# Altium schematic sheet MCU.SchDoc: Motor Controller Board
size A4; DrawnBy: Hüseyin Yanar; DocumentNumber: 2; Revision: VER 1.0; SheetNumber: 2; SheetTotal: 4
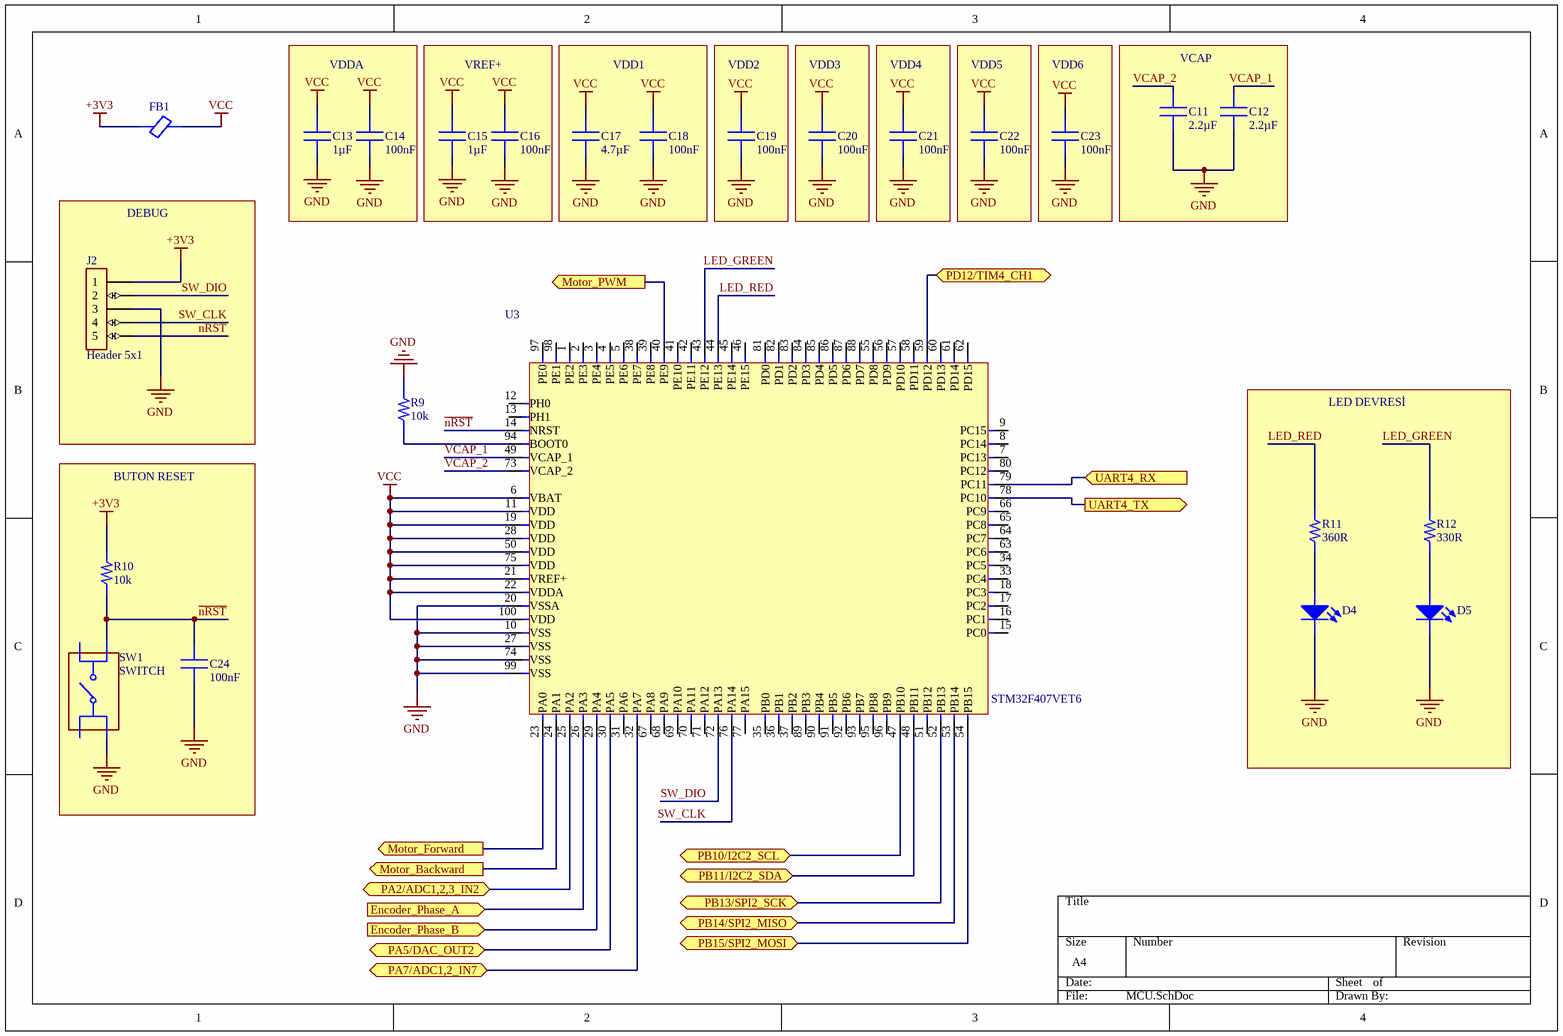
[diagram p0: MCU.SchDoc]

## Parts
C11  2.2µF  [CAP 0402 2.2UF]
C12  2.2µF  [CAP 0402 2.2UF]
C13  1µF  [CAP 1uF 0402]
C14  100nF  [CAP 100nF 0402]
C15  1µF  [CAP 1uF 0402]
C16  100nF  [CAP 100nF 0402]
C17  4.7µF  [CAP 0402 4.7uF]
C18  100nF  [CAP 100nF 0402]
C19  100nF  [CAP 100nF 0402]
C20  100nF  [CAP 100nF 0402]
C21  100nF  [CAP 100nF 0402]
C22  100nF  [CAP 100nF 0402]
C23  100nF  [CAP 100nF 0402]
C24  100nF  [CAP 100nF 0402]
D4  LED RED  [LED RED 0603 APT1608EC]  (value not drawn)
D5  LED GREEN  [LED GREEN 0603 APT1608CGCK]  (value not drawn)
FB1  BLM18PG221SN1D  [FB 0603 BLM18PG221SN1D]  (value not drawn)
J2  Header 5x1  [5x1 Header]
R9  10k  [RES 0402 ROYALOHM GENERAL]
R10  10k  [RES 0402 ROYALOHM GENERAL]
R11  360R  [ROYALOHM 0603 RES]
R12  330R  [ROYALOHM 0603 RES]
SW1  SWITCH  [PTS647SM50SMTR2 SMD BUTTON]
U3  STM32F407VET6  [LQFP100-0.5-13.8X13.8MM]

## Blocks framed on the sheet
VDDA: C13 C14
VREF+: C15 C16
VDD1: C17 C18
VDD2: C19
VDD3: C20
VDD4: C21
VDD5: C22
VDD6: C23
VCAP: C11 C12
DEBUG: J2
LED DEVRESİ: D4 D5 R11 R12
BUTON RESET: C24 R10 SW1

## Ports
Encoder_Phase_A (in, see Sensors_and_External_Interfaces[1A]), Encoder_Phase_B (in, see Sensors_and_External_Interfaces[1B]), Motor_Backward (out, see Motor_Controller[1A]), Motor_Forward (out, see Motor_Controller[1A]), Motor_PWM (out, see Motor_Controller[3C]), PA2/ADC1,2,3_IN2 (bidir, see Sensors_and_External_Interfaces[3B]), PA5/DAC_OUT2 (bidir, see Sensors_and_External_Interfaces[3B]), PA7/ADC1,2_IN7 (bidir, see Sensors_and_External_Interfaces[3B]), PB10/I2C2_SCL (bidir, see Sensors_and_External_Interfaces[3A]), PB11/I2C2_SDA (bidir, see Sensors_and_External_Interfaces[3A]), PB13/SPI2_SCK (bidir, see Sensors_and_External_Interfaces[3A]), PB14/SPI2_MISO (bidir, see Sensors_and_External_Interfaces[3A]), PB15/SPI2_MOSI (bidir, see Sensors_and_External_Interfaces[3A]), PD12/TIM4_CH1 (bidir, see Sensors_and_External_Interfaces[3A]), UART4_RX (in, see Sensors_and_External_Interfaces[3A]), UART4_TX (out, see Sensors_and_External_Interfaces[3B])

## Nets
+3V3: FB1.1 J2.1 R10.2
GND: C11.1 C12.1 C13.1 C14.1 C15.1 C16.1 C17.1 C18.1 C19.1 C20.1 C21.1 C22.1 C23.1 C24.1 D4.C(Cathode) D5.C(Cathode) J2.3 R9.2 SW1.2(A2) U3.10(VSS) U3.20(VSSA) U3.27(VSS) U3.74(VSS) U3.99(VSS)
VCC: C13.2 C14.2 C15.2 C16.2 C17.2 C18.2 C19.2 C20.2 C21.2 C22.2 C23.2 FB1.2 U3.6(VBAT) U3.11(VDD) U3.19(VDD) U3.21(VREF+) U3.22(VDDA) U3.28(VDD) U3.50(VDD) U3.75(VDD) U3.100(VDD)
~{nRST}: C24.2 J2.5 R10.1 SW1.4(B2) U3.14(NRST)
Encoder_Phase_A: U3.26(PA3) ; port Encoder_Phase_A
Encoder_Phase_B: U3.29(PA4) ; port Encoder_Phase_B
LED_GREEN: R12.2 U3.43(PE12)
LED_RED: R11.2 U3.44(PE13)
Motor_Backward: U3.24(PA1) ; port Motor_Backward
Motor_Forward: U3.23(PA0) ; port Motor_Forward
Motor_PWM: U3.40(PE9) ; port Motor_PWM
PA2/ADC1,2,3_IN2: U3.25(PA2) ; port PA2/ADC1,2,3_IN2
PA5/DAC_OUT2: U3.30(PA5) ; port PA5/DAC_OUT2
PA7/ADC1,2_IN7: U3.32(PA7) ; port PA7/ADC1,2_IN7
PB10/I2C2_SCL: U3.47(PB10) ; port PB10/I2C2_SCL
PB11/I2C2_SDA: U3.48(PB11) ; port PB11/I2C2_SDA
PB13/SPI2_SCK: U3.52(PB13) ; port PB13/SPI2_SCK
PB14/SPI2_MISO: U3.53(PB14) ; port PB14/SPI2_MISO
PB15/SPI2_MOSI: U3.54(PB15) ; port PB15/SPI2_MOSI
PD12/TIM4_CH1: U3.59(PD12) ; port PD12/TIM4_CH1
SW_CLK: J2.4 U3.76(PA14)
SW_DIO: J2.2 U3.72(PA13)
UART4_RX: U3.79(PC11) ; port UART4_RX
UART4_TX: U3.78(PC10) ; port UART4_TX
VCAP_1: C12.2 U3.49(VCAP_1)
VCAP_2: C11.2 U3.73(VCAP_2)
NetD4_A: D4.A(Anode) R11.1
NetD5_A: D5.A(Anode) R12.1
NetR9_1: R9.1 U3.94(BOOT0)

Not connected (* = marked no-connect by the designer): SW1 1(A1) 3(B1); U3 1(PE2) 2(PE3) 3(PE4) 4(PE5) 5(PE6) 7(PC13) 8(PC14) 9(PC15) 12(PH0) 13(PH1) 15(PC0) 16(PC1) 17(PC2) 18(PC3) 31(PA6) 33(PC4) 34(PC5) 35(PB0) 36(PB1) 37(PB2) 38(PE7) 39(PE8) 41(PE10) 42(PE11) 45(PE14) 46(PE15) 51(PB12) 55(PD8) 56(PD9) 57(PD10) 58(PD11) 60(PD13) 61(PD14) 62(PD15) 63(PC6) 64(PC7) 65(PC8) 66(PC9) 67(PA8) 68(PA9) 69(PA10) 70(PA11) 71(PA12) 77(PA15) 80(PC12) 81(PD0) 82(PD1) 83(PD2) 84(PD3) 85(PD4) 86(PD5) 87(PD6) 88(PD7) 89(PB3) 90(PB4) 91(PB5) 92(PB6) 93(PB7) 95(PB8) 96(PB9) 97(PE0) 98(PE1)

## Notes on the sheet
- VDDA 100nF ve 1µF VDDA/VSSA pinlerine en yakın olacak
  GND dönüşleri kısa olacak ve mümkünse analog GND bölgesine temiz inecek
  VDD 100nF’ler de her VDD pin grubuna yakın olacak.

## Library data of the parts
C11 C12 = CAP 0402 2.2uF CL05A225KO5NQNC: MLCC (1005) 0402 2.2uF 16VDC ±10% X5R CL05A225KO5NQNC; Manufacturer: SAMSUNG; Operation Temperature: -55 °C ~ +85 °C; Manufacturer Code: CL05A225KO5NQNC; Manufacturer Site: https://www.ozdisan.com/en/p/smt-smd-and-mlcc-capacitors-184/samsung-cl05a225ko5nqnc-521869; Package / Case: 0402 (1005 Metric); Capacitance: 2.2µF; Voltage Rating: 16 VDC; Tolerance: ±10 %; Dielectric Material: X5R
C13 C15 = CAP 0402 1µF CL05A105KO5NNNC: MLCC (1005) 0402 1uF 16VDC ±10% X5R CL05A105KO5NNNC; Manufacturer: SAMSUNG; Operation Temperature: -55 °C ~ +85 °C; Manufacturer Code: CL05A105KO5NNNC; Manufacturer Site: https://www.ozdisan.com/en/p/smt-smd-and-mlcc-capacitors-184/samsung-cl05a105ko5nnnc-402953; Package / Case: 0402 (1005 Metric); Capacitance: 1µF; Voltage Rating: 16 VDC; Tolerance: ±10 %; Dielectric Material: X5R; Mounting Type: SMT
C14 C16 C18-C23 = CAP 0402 100nF: MLCC (1005) 0402 100nF 16VDC ±10% X7R; Manufacturer Code: CL05B104KO5NNNC; Manufacturer: SAMSUNG; Operation Temperature: -55 °C ~ +125 °C; Dielectric Material: X7R; Tolerance: ±10 %; Voltage Rating: 16 VDC; Package / Case: 0402 (1005 Metric); Mounting Type: SMT; Manufacturer Site: https://www.ozdisan.com/en/p/smt-smd-and-mlcc-capacitors-184/samsung-cl05b104ko5nnnc-336698; Capacitance: 100 nF
C17 = CAP 0402 4.7uF CL05A475MO5LUNC: MLCC (1005) 0402 4.7uF 16VDC ±20% X5R CL05A475MO5LUNC; Manufacturer: SAMSUNG; Operation Temperature: -55 °C ~ +85 °C; Manufacturer Code: CL05A475MO5LUNC; Manufacturer Site: https://www.ozdisan.com/en/p/smt-smd-and-mlcc-capacitors-184/samsung-cl05a475mo5lunc-1212612; Package / Case: 0402 (1005 Metric); Capacitance: 4.7µF; Voltage Rating: 16 VDC; Tolerance: ±20 %; Dielectric Material: X5R; Mounting Type: SMT
C24 = CAP 0402 100nF CL05B104KO5NNNC: MLCC (1005) 0402 100nF 16VDC ±10% X7R CL05B104KO5NNNC; Manufacturer: SAMSUNG; Operation Temperature: -55 °C ~ +125 °C; Dielectric Material: X7R; Tolerance: ±10 %; Voltage Rating: 16 VDC; Package / Case: 0402 (1005 Metric); Mounting Type: SMT; Manufacturer Site: https://www.ozdisan.com/en/p/smt-smd-and-mlcc-capacitors-184/samsung-cl05b104ko5nnnc-336698; Manufacturer Code: CL05B104KO5NNNC; Capacitance: 100 nF
D4 = SMD LED RED APT1608EC: LED SMD 0603 RED 617nm CLEAR CHIP SMD; Manufacturer: KINGBRIGHT; Max Power: 75 mW; Transmission Voltage: 2.1V - 2.5V; Transmission Current: 30 mA; Manufacturer Site: https://www.ozdisan.com/p/sinyal-ledler-tek-renkli-361/kingbright-apt1608ec-1046629; Operating Temp.: -40 °C ~ +85 °C; Manufacturer Code: APT1608EC
D5 = SMD LED GREEN APT1608CGCK: LED GREEN CLEAR CHIP SMD; Manufacturer: KINGBRIGHT; Max Power: 75 mW; Light Intensity: 18 - 35 cmd; Transmission Voltage: 2.1 - 2.5V; Transmission Current: 30 mA; Manufacturer Site: https://www.ozdisan.com/p/sinyal-ledler-tek-renkli-361/kingbright-apt1608cgck-1050108; Color: Green; Package Size: 0603; Operating Temp.: -30 °C ~ +85 °C; Manufacturer Code: APT1608CGCK
FB1 = Ferrite Bead BLM18PG221SN1D: FERRITE BEAD 0805 330R/100MHZ  BLM18PG221SN1D  SMD; Manufacturer: MURATA; Impedance: 330 Ohms; Tolerance: ±25 %; Current: 1.5 A; DC Resistor(DCR): 100 m Ohms; Package Size: 0805; Manufacturer Code: BLM18PG221SN1D; Manufacturer Site: https://www.ozdisan.com/p/bead-feritler-469/murata-blm18pg221sn1d-484088
J2 = Header 5x1 for SWD: PIN HEADER 5PIN (5x1) 2.54mm THT V/T; Manufacturer: CONNFLY; Manufacturer Code: DS1021-1X5SF11-B; Pin Overall Length: 15.04 mm; Pin Spacing: 2.54 mm; Insulation Height: 2.5 mm; Manufacturer Site: https://www.ozdisan.com/p/pin-headerlar-293/connfly-ds1021-1x5sf11-b-423156
R9 R10 = RES 0402 10k: RES.(1005) 0402 10K Ohms 5% 1/16W 100PPM 0402WGJ0103TCE; Manufacturer: ROYALOHM; Tolerance: %5; Voltage Rating: 5V; Manufacturer Site: https://www.ozdisan.com/p/smt-smd-ve-cip-direncler-194/royalohm-0402wgj0103tce-362331; Package Size: 0402; Manufacturer Code: 0402WGJ0103TCE; Power: 1/16W; Resistance Value: 10k Ohms
R11 = RES 0603 360R 0603SAJ0361T5E: RES.(1608) 0603 360 Ohms 5% 1/10W-S 100PPM 0603SAJ0361T5E; Manufacturer: ROYALOHM; Working Voltage: 75 V; Manufacturer Code: 0603SAJ0361T5E; Manufacturer Site: https://www.ozdisan.com/en/p/smt-smd-and-chip-resistors-194/royalohm-0603saj0361t5e-404344; Resistance Value: 360 Ohms; Tolerance: ±5 %
R12 = RES 0603 330R: RES 0603 330 Ohms 5% 1/10W-S 100PPM; Manufacturer Code: 0603SAJ0331T5E; Manufacturer: ROYALOHM; Power: 1/10W; Voltage Rating: 75V; Resistance Value: 330 Ohm; Manufacturer Site: https://www.ozdisan.com/p/smt-smd-ve-cip-direncler-194/royalohm-0603saj0331t5e-336229; Tolerance: ±5 %; Package Size: 0603
SW1 = SMD BUTTON PTS647SM50SMTR2LFS: SWITCH TACT 6.00x6.00 8.00mm 160gF SMT V/T PTS647SM50SMTR2LFS; Manufacturer: LITTELFUSE-C&K; Max Current: 50mA; Max Voltage: 12V; Actuating Force: 180 gF; Manufacturer Site: https://www.ozdisan.com/p/tact-sivicler-485/littelfuse-ck-pts647sm50smtr2lfs-1018623; Dimension: 4.5x4.5 mm; Operating Temp.: -25 °C ~ +70 °C; Manufacturer Code: PTS647SM50SMTR2LFS
U3 = MCU-STM32F407VET6(LQFP100): IC-32F407V MCU 32BIT 512KB FLASH 100LQFP; Manufacturer: STM; Manufacturer Code: STM32F407VET6TR; Supply Voltage: 1.8 to 3.6 V; Speed: 168 MHz; Program Memory Size: 512 KB (512 K x 8); Package / Case: LQFP100; Memory Type: FLASH; Number of Bits: 32 Bit; Operating Temperature: -40 °C ~ +85 °C; Manufacturer Site: https://www.ozdisan.com/en/p/microcontrollers-218/stm-stm32f407vet6tr-492058